# Altium project EAX300_TesterControlBoard.PrjPcb
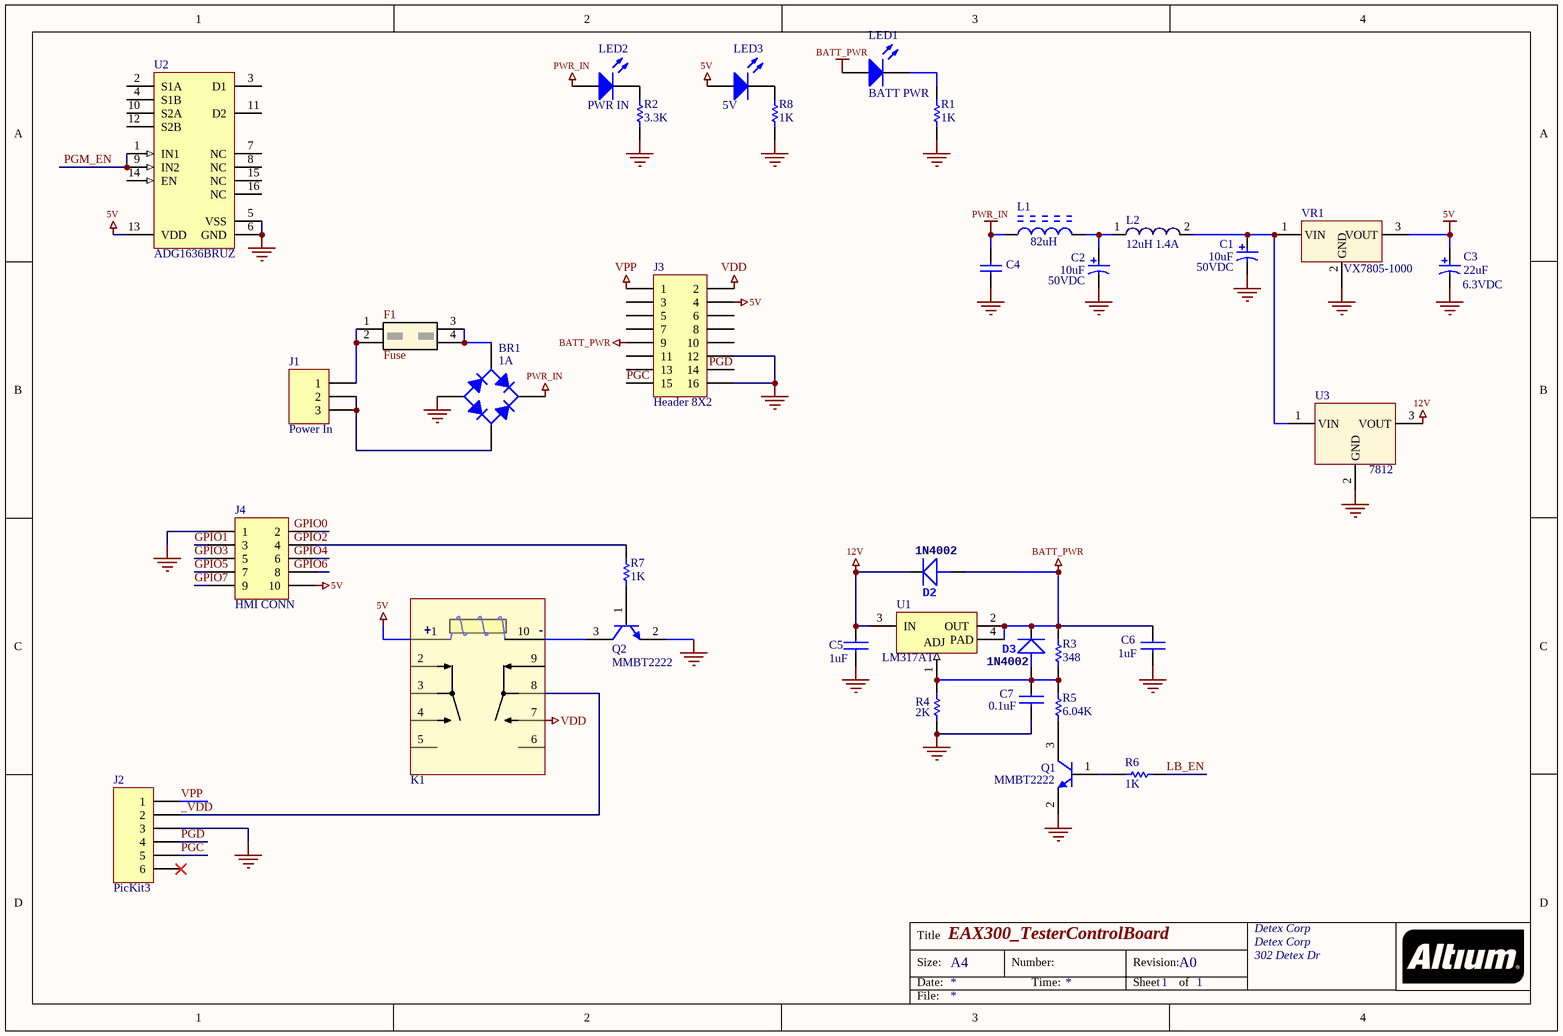
[diagram p0: EAX300_TesterControlBoard.SchDoc]
rev: A0; title: EAX300_TesterControlBoard
1 sheet, 35 parts. Net scope: global (net labels, ports and power ports of the same name join across sheets).
Board file: EAX300_TesterControlBoard.PcbDoc

## Sheet EAX300_TesterControlBoard.SchDoc: EAX300_TesterControlBoard
size A4; DrawnBy: DMH; Engineer: DMH; Organization: Detex Corp; Address1: Detex Corp; Address2: 302 Detex Dr; Revision: A0; SheetNumber: 1; SheetTotal: 1

### Parts
BR1  1A  [BRIDGE_1A_SMT]
C1  10uF  Voltage: 50VDC  [KEMT-D-7343-31-2_M]
C2  10uF  Voltage: 50VDC  [KEMT-D-7343-31-2_M]
C3  22uF  Voltage: 6.3VDC  [KEMT-D-7343-31-2_M]
C4  B72220S1300K102  [TDK-S20K275]  (value not drawn)
C5  1uF  [CAPC0805(2012)75_N]
C6  1uF  [CAPC0805(2012)75_N]
C7  0.1uF  [CAPC0805(2012)75_N]
D2  1N4002  [DO-214AC]
D3  1N4002  [DO-214AC]
F1  Amperage: Fuse  [AUTO-FUSE HOLDER]  (hidden comment: PC Auto Fuse Holder)
J1  Power In  [KLD-0202_2]
J2  PicKit3  [HDR1X6]
J3  Header 8X2  [HDR2X8]
J4  HMI CONN  [HDR2X5]
K1  QW POWER  [AZ_940]  (value not drawn)
L1  82uH  [BOUR-SRR1280-2_V]
L2  12uH 1.4A  [WE-LQS 4018]
LED1  BATT PWR  [LED_1206_2]
LED2  PWR IN  [LED_1206_2]
LED3  5V  [LED_1206_2]
Q1  MMBT2222  [ONSC-SOT-23-3-318-08_V]
Q2  MMBT2222  [ONSC-SOT-23-3-318-08_V]
R1  value 1K  [RES_0805]  (hidden comment: 0805)
R2  value 3.3K  [RES_0805]  (hidden comment: 0805)
R3  value 348  [RES_0805]  (hidden comment: 0805)
R4  value 2K  [RES_0805]  (hidden comment: 0805)
R5  value 6.04K  [RES_0805]  (hidden comment: 0805)
R6  value 1K  [RES_0805]  (hidden comment: 0805)
R7  value 1K  [RES_0805]  (hidden comment: 0805)
R8  value 1K  [RES_0805]  (hidden comment: 0805)
U1  LM317AT  [SOT223_M]
U2  ADG1636BRUZ  [ADI-RU-16_N]
U3  7812  [7812]
VR1  VX7805-1000  [78xx]

### Nets
5V: C3.1 J3.4 J4.10 K1.1(V+) LED3.1(A) U2.13(VDD) VR1.3(VOUT)
12V: C5.1 D2.2 U1.3(IN) U3.3(VOUT)
BATT_PWR: C6.1 D2.1 D3.2 J3.9 LED1.1(A) R3.2 U1.2(OUT) U1.4(PAD)
GND: BR1.3(A) C1.2 C2.2 C3.2 C4.2 C5.2 C6.2 C7.2 J2.3 J3.12 J3.16 J4.1 Q1.2(E) Q2.2(E) R1.1 R2.2 R4.1 R8.1 U2.5(VSS) U2.6(GND) U3.2(GND) VR1.2(GND)
PWR_IN: BR1.1(K) C4.1 L1.1 LED2.1(A)
VDD: J3.2 K1.7(N/O)
VPP: J2.1 J3.1
_VDD: J2.2 K1.8(COM)
GPIO0: J4.2
GPIO1: J4.3
GPIO2: J4.4 R7.1
GPIO3: J4.5
GPIO4: J4.6
GPIO5: J4.7
GPIO6: J4.8
GPIO7: J4.9
LB_EN: R6.1
PGC: J2.5 J3.15
PGD: J2.4 J3.14
PGM_EN: U2.1(IN1) U2.9(IN2)
NetBR1_2: BR1.2(C) J1.2 J1.3
NetBR1_4: BR1.4(C) F1.3 F1.4
NetC1_1: C1.1 L2.2 U3.1(VIN) VR1.1(VIN)
NetC2_1: C2.1 L1.2 L2.1
NetC7_1: C7.1 D3.1 R3.1 R4.2 R5.2 U1.1(ADJ)
NetF1_1: F1.1 F1.2 J1.1
NetK1_10: K1.10(V-) Q2.3(C)
NetLED1_2: LED1.2(K) R1.2
NetLED2_2: LED2.2(K) R2.1
NetLED3_2: LED3.2(K) R8.2
NetQ1_1: Q1.1(B) R6.2
NetQ1_3: Q1.3(C) R5.1
NetQ2_1: Q2.1(B) R7.2

Not connected (* = marked no-connect by the designer): J2 6*; J3 3 5 6 7 8 10 11 13; K1 2(N/C) 3(COM) 4(N/O) 5 6 9(N/C); U2 2(S1A) 3(D1) 4(S1B) 7(NC) 8(NC) 10(S2A) 11(D2) 12(S2B) 14(EN) 15(NC) 16(NC)

### Notes on the sheet
- Title
- Size:
- Date:
- A4
- Number:
- Time:
- Revision:
- Sheet
- of
- File:
- (in symbol Relay_1) +; -

### Library data of the parts
BR1 = Bridge1: Full Wave Diode Bridge; Published: 8-Jun-2000; LatestRevisionDate: 29-May-2009; LatestRevisionNote: Sch pins A & K swapped.; DatasheetVersion: E2732B; PackageReference: D-38; Publisher: Altium Limited; PackageDescription: Bridge Rectifier; 4 Terminals; Body 9.4 x 9.4 mm (typ); Pitch 5.08 mm
C1 C2 = CMP-2000-05176-1: Capacitor, Tantalum, 10 uF, +/- 10%, 50 V, -55 to 125 degC, 2-Pin SMD, RoHS, Tape and Reel; MFR: AVR; Polarity: Polar; ESR: 90mOhm; Tolerance (+ or -): 20%; Operating Temp Range: -55Cto125C; Capacitance: 10uF; Packaging: TapeandReel; Mounting Style: SurfaceMount
C3 = CMP-2000-05176-1: Capacitor, Tantalum, 22 uF, +/- 10%, 6.3V, -55 to 125 degC, 2-Pin SMD, RoHS, Tape and Reel; Manufacturer: Kemet; MFR P/N: TCQB226M006R0070E; MFR: AVX; Polarity: Polar; ESR: 70Ohm; Manufacturer URL: http://www.kemet.com/; Capacitance: 22uF; Construction: SMTChip; Package / Case: 2510; Mounting Style: SurfaceMount; Tolerance (+ or -): 10%
C4 = CMP-2000-05911-1: Leaded Varistor, 850 pF, 275 Vrms, 8 KA, -40 to 85 degC, 2-Pin THD, RoHS, Bulk; MFR: TDK; Package Reference: S20K275; Mounting Technology: ThroughHole; MFR P/N: B72220S1300K102; Manufacturer URL: http://www.tdk.com/
C5-C7 = GRM21BR71H105KA12L: CAP CER 1UF 50V X7R 0805; Manufacturer: Murata Electronics North America; Capacitance: 1.0µF; .Checked PCB: used; Tolerance: ±10%; Category: Capacitors; Manufacturer Part Number: GRM21BR71H105KA12L; Operating Temperature: -55°C ~ 125°C; Package / Case: 0805 (2012 Metric); Price 1k [$]: 0.1359; Value: 1uF; .Checked SCH: used; Voltage - Rated: 50V; Supplier Part Number: 490-4736-1-ND; Supplier: Digikey; Supplier 1: Digi-Key; Supplier Part Number 1: 490-4736-1-ND; RoHS: RoHS Compliant; Stock 1: 422791; Pricing 1: 1=0.28, 10=0.254, 25=0.226, 50=0.1978, 100=0.1836, 250=0.16952, 500=0.16102, 750=0.14691, 1000=0.12995 (USD); Temperature Coefficient: X7R; Mounting Type: Surface Mount, MLCC; Applications: General Purpose; Ratings: -; Size / Dimension: 0.079" L x 0.049" W (2.00mm x 1.25mm); Height - Seated (Max): -; Thickness (Max): 0.053" (1.35mm); Lead Spacing: -; Features: -; Packaging: Cut Tape (CT); Lead Style: -; ComponentLink1URL: http://search.murata.co.jp/Ceramy/image/img/PDF/ENG/GRM21BR71H105KA12.pdf; ComponentLink1Description: http://search.murata.co.jp/Ceramy/image/img/PDF/ENG/GRM21BR71H105KA12.pdf
D2 D3 = 1N4004SMT: pin to pad: 1>+ 2>-; Value: {Value}
F1 = PC Auto Fuse Holder: Fuse Holder 2 IN 1 AUTO BLDE HOLDER; MPN: 3587-10; MFR: Keystone Electronics; ComponentLink1URL: http://www.mouser.com/ds/2/215/557-10-961412.pdf; ComponentLink1Description: Datasheet
J1 = Header 3: Header, 3-Pin; pin to pad: 1>2 2>1; LatestRevisionDate: 17-Jul-2002; LatestRevisionNote: Re-released for DXP Platform.; Publisher: Altium Limited
J2 = Header 6: PicKit3 Connector
J3 = Header 8X2: Header, 8-Pin, Dual row; LatestRevisionDate: 17-Jul-2002; LatestRevisionNote: Re-released for DXP Platform.; Publisher: Altium Limited
J4 = Header 5X2: Header, 5-Pin, Dual row; LatestRevisionDate: 17-Jul-2002; LatestRevisionNote: Re-released for DXP Platform.; Publisher: Altium Limited
K1 = Relay_1: AZ850-5; Part Number: 101671; ComponentLink1Description: Datasheet; ComponentLink1URL: http://www.azettler.com/pdfs/az850.pdf
L1 = CMP-2000-07148-1: Shielded SMD Power Inductor, 82 uH, +/- 20%, -40 to 125 degC, 2-Pin SMD, RoHS, Tape and Reel; MFR: Bourns; MFR P/N: SRR1280-820M; DC Resistance Max: 57MOhm; Maximum Self Resonant Frequency: 9.5MHz; DC Current Max: 3.5A; Core Material: Ferrite; Maximum DC Resistance: 57mΩ; Manufacturer URL: http://www.bourns.com/; Minimum Operating Temperature: -40°C; Inductance: 82uH; Maximum Operating Temperature: +125°C; Tolerance: 20%; Series: SRR1280; Mounting Technology: SurfaceMount; Maximum DC Current: 3.5A
L2 = CMP-1354-00035-1: SMD Power Inductor, L=12 µH; MFR: Bourns; MFR P/N: SRN5020TA-120M; Inductance: 12µH; ComponentLink1Description: Manufacturer URL; ComponentLink2Description: Datasheet; ComponentLink2URL: http://katalog.we-online.de/pbs/datasheet/74404042068.pdf; ComponentLink1URL: http://www.we-online.com
LED1-LED3 = LED3: Typical BLUE SiC LED; Published: 8-Jun-2000; LatestRevisionDate: 17-Dec-2003; LatestRevisionNote: PCB Footprint replaced.; DatasheetVersion: 16-Apr-2002; PackageVersion: 16-Apr-2002; PackageReference: 3.5X2.8X1.9; Publisher: Altium Limited; PackageDescription: SM LED; 2 C-Bend Leads; Body 3.5 x 2.8 x 1.9 mm, inc leads (LxWxH typ)
Q1 Q2 = CMP-0722-00001-2: General Purpose Transistor, NPN Silicon, 3-Pin SOT-23, Pb-Free, Tape and Reel; PartNumber: MMBT2222LT1G; Manufacturer: On Semiconductor; IC Continuous (A): 0.6; fT Min (MHz): 250; DatasheetVersion: Rev. 10; ComponentLink3Description: Package Specification; PackageVersion: Rev. AP, 11/2009; ComponentLink3URL: http://www.onsemi.cn/pub_link/Collateral/318-08.PDF; ComponentLink1URL: http://www.onsemi.com/; ComponentLink2URL: http://www.onsemi.cn/pub_link/Collateral/MMBT2222LT1-D.PDF; ComponentLink2Description: Datasheet; RoHS: TRUE; Mounting Technology: Surface Mount; ComponentLink1Description: Manufacturer URL; PackageDescription: 3-Pin Small Outline Transistor, Body 2.92 x 1.3 mm, Pitch 0.95 mm; Packing: Tape and Reel; Polarity: NPN; PackageReference: SOT-23-3-318-08
R1-R8 = Res Semi: Semiconductor Resistor; Published: 8-Jun-2000; LatestRevisionDate: 17-Jul-2002; LatestRevisionNote: Re-released for DXP Platform.; PackageReference: AXIAL-0.5; Publisher: Altium Limited; PackageDescription: Axial Device, Thru-Hole; 2 Leads; 0.5 in Pin Spacing
U1 = LM317: 3-Terminal Adjustable Regulator, 3-pin TO-220, Pb-Free; MFR: ON Semiconductor; CompType: LDO IC; Parameter 1: LM317MBSTT3G; RoHS: Y; ComponentLink1Description: LM317 Datasheet; ComponentLink2Description: LM317 Web Page; PinCount: 4; ComponentLink2URL: http://www.national.com/pf/LM/LM317.html; ComponentLink1URL: http://www.national.com/ds/LM/LM317.pdf
U2 = CMP-0790-00227-1: 1 Ohm Typical on Resistance, +/-5 V, +12 V, +5 V, and +3.3 V Dual SPDT Switch, -40 to 125 degC, 16-pin SOP (RU-16), Tube; Manufacturer: Analog Devices; Power Dissipation: 4.5mW; Id, Is (ON): 300pA, 300pA, 100pA, 50pA; Is OFF: 100pA, 100pA, 50pA, 20pA; Ron (ohms): 1; PartNumber: ADG1636BRUZ; PackageVersion: Nov-02; Mounting Technology: Surface Mount; ComponentLink2Description: Datasheet; ComponentLink3Description: Package Specification; Packing: Tube; Configuration: SPDT; ComponentLink3URL: http:/www.analog.com/static/imported-files/packages/36244347913743854010197452789RU16.pdf; Code_JEDEC: MO-153AB; DatasheetVersion: Rev. A; ComponentLink2URL: http://www.analog.com/static/imported-files/data_sheets/ADG1636.pdf; ComponentLink1URL: http://www.analog.com/en/index.html; ComponentLink1Description: Manufacturer URL; PackageReference: RU-16; PackageDescription: 16-Pin Thin Shrink Small Outline Package, Body 5 x 4.4 mm, Pitch 0.65 mm
VR1 = VX78xx: Non-Isolated DC Switching Regulator; MFR: CUI, Inc.; MFR P/N: VX7805-1000; Footprint: *; ComponentLink1Description: Datasheet; ComponentLink1URL: https://www.cui.com/product/resource/vx78-1000.pdf